# Altium schematic sheet Sound Intimator.SchDoc
size 297 x 210 mm
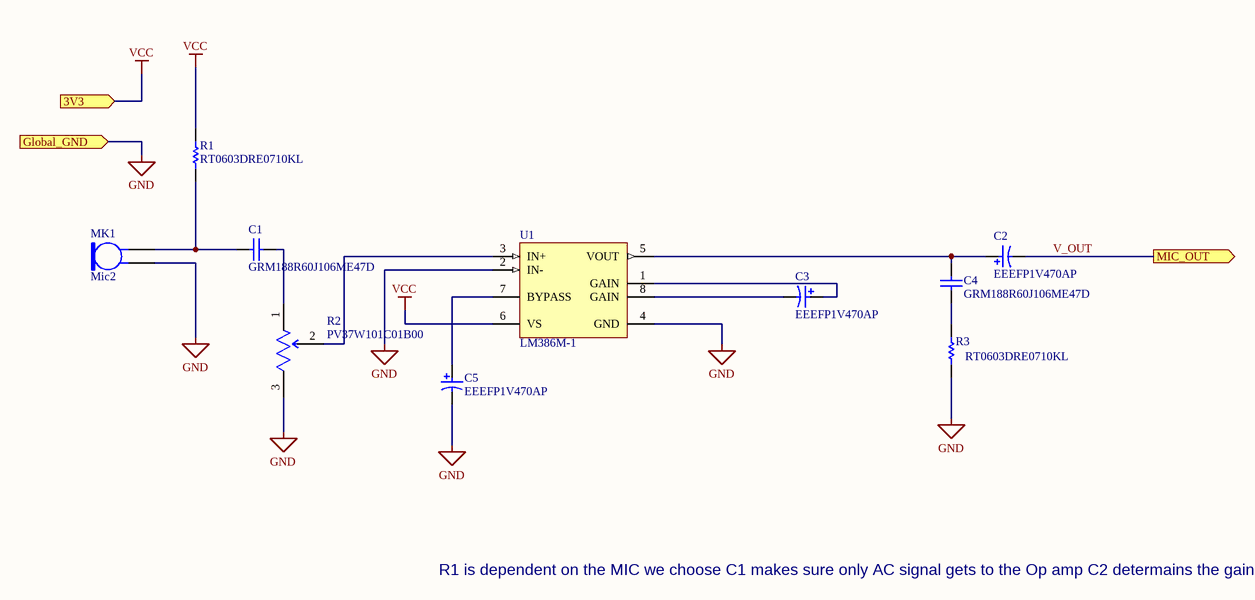
[diagram p0: Sound Intimator.SchDoc]

## Parts
C1  GRM188R60J106ME47D  [CAPC1608X90X35NL10T15]
C2  EEEFP1V470AP  [PNSC-FP-V-D_V]
C3  EEEFP1V470AP  [PNSC-FP-V-D_V]
C4  GRM188R60J106ME47D  [CAPC1608X90X35NL10T15]
C5  EEEFP1V470AP  [PNSC-FP-V-D_V]
MK1  Mic2  [PIN2]
R1  RT0603DRE0710KL  [RESC1608X55X25ML10T15]
R2  PV37W101C01B00  [FP-PV37W101C01B00-MFG]
R3  RT0603DRE0710KL  [RESC1608X55X25ML10T15]
U1  LM386M-1  [D0008A_M]

## Ports
3V3 (in), Global_GND (in), MIC_OUT (out)

## Nets
GND: C5.2 MK1.1 R2.3 R3.1 U1.2(IN-) U1.4(GND) ; port Global_GND
VCC: R1.2 U1.6(VS) ; port 3V3
V_OUT: C2.2 ; port MIC_OUT
NetC1_1: C1.1 MK1.2 R1.1
NetC1_2: C1.2 R2.1
NetC2_1: C2.1 C4.2 U1.5(VOUT)
NetC3_1: C3.1 U1.1(GAIN)
NetC3_2: C3.2 U1.8(GAIN)
NetC4_1: C4.1 R3.2
NetC5_1: C5.1 U1.7(BYPASS)
NetR2_2: R2.2 U1.3(IN+)

## Notes on the sheet
- R1 is dependent on the MIC we choose
  C1 makes sure only AC signal gets to the Op amp
  C2 determains the gain of the OP Amp 20 to 200 gain
  C7 Is the Bypass Capacitor for stability of the op amp
  C3 removes the DC offset of the Output
- 1
- 2
- 3
- 4
- 5
- 6
- A
- B
- C
- D
- Title:
- File: Sound Intimator.sch
- Sheet: /
- KiCad E.D.A.  kicad (5.1.4)-1
- Size: A4
- Date:
- Rev:
- Id: 2/4

## Library data of the parts
C1 C4 = CMP-2006-02792-1: Manufacturer: Murata; Part Number: GRM188R60J106ME47D
C2 C3 C5 = CMP-2000-06216-1: Aluminum Electrolytic Capacitor, 47 uF, +/- 20%, 35 V, 2-Pin SMD (Size Code D), -55 to 105 degC, RoHS, Tape and Reel; Manufacturer: Panasonic; Lifetime@Temperature: 2000Hrs@105°C; Capacitance: 47µF; Type: Can; Rated Voltage: 35V; Ripple Current: 300mA; ESR (Equivalent Series Resistance): 0.26O; Package Reference: FP-V-D; Package Description: 2-Pin Electrolytic Aluminum Capacitor, Body 6.6 x 6.6 mm; Datasheet URL: http://industrial.panasonic.com/cdbs/www-data/pdf/RDE0000/ABA0000C1184.pdf; Series: FP; Operating Temp Range: -55to+105°C; Operating Temp-Max: 105°C; Datasheet Version: 03/2016; Manufacturer URL: http://www.panasonic.com/; Package URL: http://industrial.panasonic.com/cdbs/www-data/pdf/RDE0000/DME0000COL48.pdf; Case Size/Dimension: Ø6.3x5.8mm; Mounting Technology: SurfaceMount
MK1 = Mic2: Microphone; Published: 24-Mar-1999; LatestRevisionDate: 17-Jul-2002; LatestRevisionNote: Re-released for DXP Platform.; PackageReference: PIN2; Publisher: Altium Limited
R1 R3 = CMP-2000-04608-1: Manufacturer: Yageo; Part Number: RT0603DRE0710KL
R2 = CMP-06028-000002-1: TRIMMER 100 OHM 0.25W PC PIN TOP; Power Rating: 250mW; Number of Turns: 12; Temperature Coefficient: 150ppm/°C; Resistance: 100R; Tolerance: 10%; Max Operating Temperature: 125°C; Lead Free: Lead Free; Mount: Through Hole; Width: 0.157inch; Composition: Cermet; Package Quantity: 50; Color: Grey; Weight: 340mg; Max Power Dissipation: 250mW; Radiation Hardening: No; Min Operating Temperature: -55°C; Height: 0.264inch; Packaging: Bulk; Length: 0.252inch; Termination: PC Pin; Taper: Linear
U1 = CMP-0057-00421-3: Low Voltage Audio Power Amplifier, 8-pin Narrow SOIC; Manufacturer: Texas Instruments; PackageTopMarking: NSZXTT*LM386*M-1; CompType: Audio IC; PowerWise: N; ComponentLink1Description: Datasheet URL; Code_IPC: SOIC127P600-8; PackageDescription: SOIC Narrow, 4.9 x 3.9 x 1.45mm, 8 Lead, 1.27mm Pitch; Code_JEDEC: MS-012-AA; PinCount: 8; ComponentLink1URL: http://www.ti.com/general/docs/lit/getliterature.tsp?genericPartNumber=LM386&fileType=pdf; RoHS: N; PackageReference: D0008A